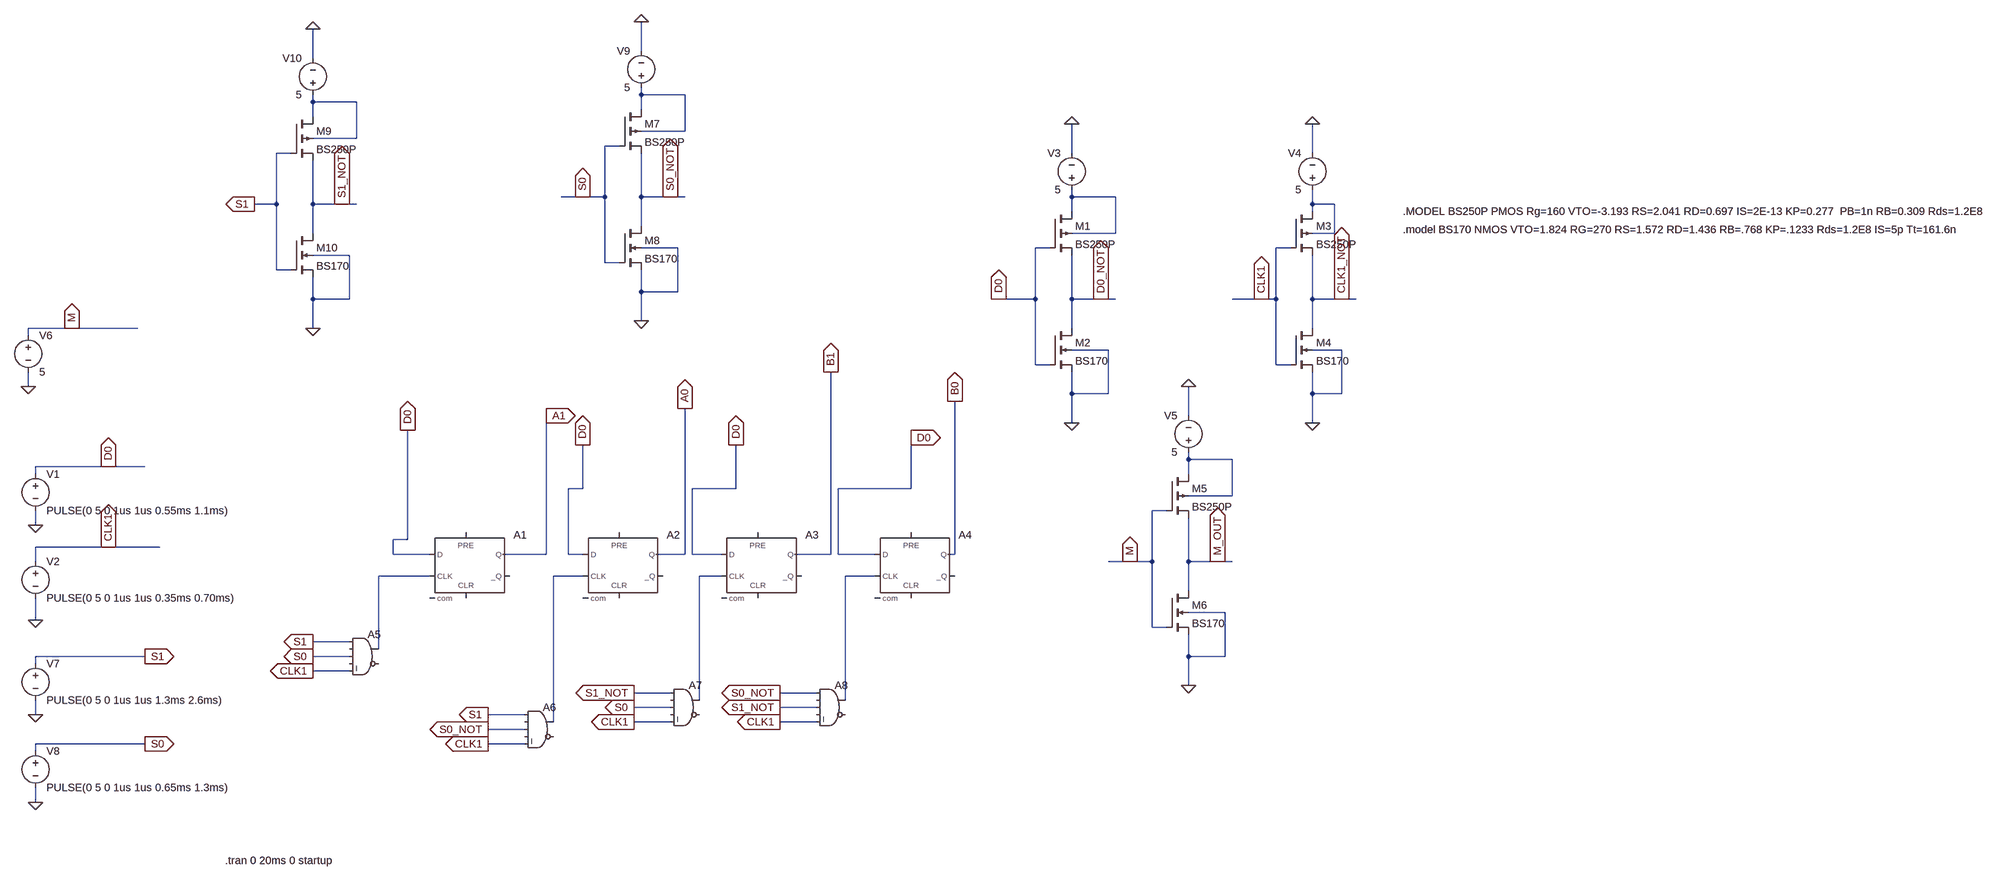
[diagram p0: schematic TASK_3.asc]
TASK_3.asc, the LTspice schematic file:
Version 4
SHEET 1 880 680
WIRE -3024 -2976 -3024 -3040
WIRE -3744 -2960 -3744 -3024
WIRE -3024 -2880 -3024 -2896
WIRE -2928 -2880 -3024 -2880
WIRE -3744 -2864 -3744 -2880
WIRE -3648 -2864 -3744 -2864
WIRE -3024 -2848 -3024 -2880
WIRE -3744 -2832 -3744 -2864
WIRE -2928 -2800 -2928 -2880
WIRE -2928 -2800 -3024 -2800
WIRE -3648 -2784 -3648 -2864
WIRE -3648 -2784 -3744 -2784
WIRE -3072 -2768 -3104 -2768
WIRE -3792 -2752 -3824 -2752
WIRE -2080 -2752 -2080 -2816
WIRE -1552 -2752 -1552 -2816
WIRE -3152 -2656 -3200 -2656
WIRE -3104 -2656 -3104 -2768
WIRE -3104 -2656 -3152 -2656
WIRE -3024 -2656 -3024 -2752
WIRE -2960 -2656 -3024 -2656
WIRE -2928 -2656 -2960 -2656
WIRE -2080 -2656 -2080 -2672
WIRE -1984 -2656 -2080 -2656
WIRE -3824 -2640 -3824 -2752
WIRE -3824 -2640 -3872 -2640
WIRE -3744 -2640 -3744 -2736
WIRE -3680 -2640 -3744 -2640
WIRE -3648 -2640 -3680 -2640
WIRE -1552 -2640 -1552 -2672
WIRE -1504 -2640 -1552 -2640
WIRE -2080 -2624 -2080 -2656
WIRE -1552 -2624 -1552 -2640
WIRE -3024 -2592 -3024 -2656
WIRE -3744 -2576 -3744 -2640
WIRE -1984 -2576 -1984 -2656
WIRE -1984 -2576 -2080 -2576
WIRE -1504 -2576 -1504 -2640
WIRE -1504 -2576 -1552 -2576
WIRE -2944 -2544 -3024 -2544
WIRE -2128 -2544 -2160 -2544
WIRE -1600 -2544 -1632 -2544
WIRE -3664 -2528 -3744 -2528
WIRE -3104 -2512 -3104 -2656
WIRE -3072 -2512 -3104 -2512
WIRE -3824 -2496 -3824 -2640
WIRE -3792 -2496 -3824 -2496
WIRE -3024 -2448 -3024 -2496
WIRE -2944 -2448 -2944 -2544
WIRE -2944 -2448 -3024 -2448
WIRE -3744 -2432 -3744 -2480
WIRE -3664 -2432 -3664 -2528
WIRE -3664 -2432 -3744 -2432
WIRE -2240 -2432 -2256 -2432
WIRE -2160 -2432 -2160 -2544
WIRE -2160 -2432 -2240 -2432
WIRE -2080 -2432 -2080 -2528
WIRE -2016 -2432 -2080 -2432
WIRE -1984 -2432 -2016 -2432
WIRE -1664 -2432 -1728 -2432
WIRE -1632 -2432 -1632 -2544
WIRE -1632 -2432 -1664 -2432
WIRE -1552 -2432 -1552 -2528
WIRE -1488 -2432 -1552 -2432
WIRE -1456 -2432 -1488 -2432
WIRE -3024 -2384 -3024 -2448
WIRE -4272 -2368 -4368 -2368
WIRE -4128 -2368 -4272 -2368
WIRE -3744 -2368 -3744 -2432
WIRE -2080 -2368 -2080 -2432
WIRE -1552 -2368 -1552 -2432
WIRE -4368 -2352 -4368 -2368
WIRE -2000 -2320 -2080 -2320
WIRE -1488 -2320 -1552 -2320
WIRE -2160 -2288 -2160 -2432
WIRE -2128 -2288 -2160 -2288
WIRE -1632 -2288 -1632 -2432
WIRE -1600 -2288 -1632 -2288
WIRE -4368 -2240 -4368 -2272
WIRE -2080 -2224 -2080 -2272
WIRE -2000 -2224 -2000 -2320
WIRE -2000 -2224 -2080 -2224
WIRE -1552 -2224 -1552 -2272
WIRE -1488 -2224 -1488 -2320
WIRE -1488 -2224 -1552 -2224
WIRE -3232 -2176 -3232 -2192
WIRE -1824 -2176 -1824 -2240
WIRE -2080 -2160 -2080 -2224
WIRE -1552 -2160 -1552 -2224
WIRE -2432 -2128 -2432 -2144
WIRE -1824 -2080 -1824 -2096
WIRE -1728 -2080 -1824 -2080
WIRE -4192 -2064 -4352 -2064
WIRE -4112 -2064 -4192 -2064
WIRE -4352 -2048 -4352 -2064
WIRE -1824 -2048 -1824 -2080
WIRE -3152 -2016 -3152 -2112
WIRE -3152 -2016 -3184 -2016
WIRE -2816 -2016 -2816 -2112
WIRE -2816 -2016 -2912 -2016
WIRE -2432 -2016 -2432 -2128
WIRE -2432 -2016 -2592 -2016
WIRE -1728 -2000 -1728 -2080
WIRE -1728 -2000 -1824 -2000
WIRE -1872 -1968 -1904 -1968
WIRE -4352 -1936 -4352 -1968
WIRE -3536 -1904 -3536 -2144
WIRE -3536 -1904 -3568 -1904
WIRE -4192 -1888 -4352 -1888
WIRE -4080 -1888 -4192 -1888
WIRE -3568 -1872 -3568 -1904
WIRE -3488 -1872 -3568 -1872
WIRE -3232 -1872 -3232 -2176
WIRE -3232 -1872 -3328 -1872
WIRE -3184 -1872 -3184 -2016
WIRE -3152 -1872 -3184 -1872
WIRE -2928 -1872 -2928 -2192
WIRE -2928 -1872 -2992 -1872
WIRE -2912 -1872 -2912 -2016
WIRE -2848 -1872 -2912 -1872
WIRE -2608 -1872 -2608 -2272
WIRE -2608 -1872 -2688 -1872
WIRE -2592 -1872 -2592 -2016
WIRE -2512 -1872 -2592 -1872
WIRE -2336 -1872 -2336 -2208
WIRE -2336 -1872 -2352 -1872
WIRE -4352 -1856 -4352 -1888
WIRE -1952 -1856 -2000 -1856
WIRE -1904 -1856 -1904 -1968
WIRE -1904 -1856 -1952 -1856
WIRE -1824 -1856 -1824 -1952
WIRE -1760 -1856 -1824 -1856
WIRE -1728 -1856 -1760 -1856
WIRE -3488 -1824 -3600 -1824
WIRE -3152 -1824 -3216 -1824
WIRE -2848 -1824 -2896 -1824
WIRE -2512 -1824 -2576 -1824
WIRE -1824 -1792 -1824 -1856
WIRE -1744 -1744 -1824 -1744
WIRE -4352 -1728 -4352 -1776
WIRE -1904 -1712 -1904 -1856
WIRE -1872 -1712 -1904 -1712
WIRE -3664 -1680 -3744 -1680
WIRE -3600 -1664 -3600 -1824
WIRE -4112 -1648 -4352 -1648
WIRE -3664 -1648 -3744 -1648
WIRE -1824 -1648 -1824 -1696
WIRE -1744 -1648 -1744 -1744
WIRE -1744 -1648 -1824 -1648
WIRE -4352 -1632 -4352 -1648
WIRE -3664 -1616 -3744 -1616
WIRE -1824 -1584 -1824 -1648
WIRE -2960 -1568 -3040 -1568
WIRE -2640 -1568 -2720 -1568
WIRE -2896 -1552 -2896 -1824
WIRE -2576 -1552 -2576 -1824
WIRE -2960 -1536 -3040 -1536
WIRE -2640 -1536 -2720 -1536
WIRE -4352 -1520 -4352 -1552
WIRE -3280 -1520 -3360 -1520
WIRE -3216 -1504 -3216 -1824
WIRE -2960 -1504 -3040 -1504
WIRE -2640 -1504 -2720 -1504
WIRE -3280 -1488 -3360 -1488
WIRE -4112 -1456 -4352 -1456
WIRE -3280 -1456 -3360 -1456
WIRE -4352 -1440 -4352 -1456
WIRE -4352 -1328 -4352 -1360
FLAG -4352 -1936 0
FLAG -4352 -1728 0
FLAG -4192 -2064 D0
IOPIN -4192 -2064 Out
FLAG -4192 -1888 CLK1
IOPIN -4192 -1888 Out
FLAG -2080 -2816 0
FLAG -2080 -2160 0
FLAG -1552 -2816 0
FLAG -1552 -2160 0
FLAG -2240 -2432 D0
IOPIN -2240 -2432 Out
FLAG -2016 -2432 D0_NOT
IOPIN -2016 -2432 Out
FLAG -1664 -2432 CLK1
IOPIN -1664 -2432 Out
FLAG -1488 -2432 CLK1_NOT
IOPIN -1488 -2432 Out
FLAG -1824 -2240 0
FLAG -1824 -1584 0
FLAG -4368 -2240 0
FLAG -4272 -2368 M
IOPIN -4272 -2368 Out
FLAG -1952 -1856 M
IOPIN -1952 -1856 Out
FLAG -1760 -1856 M_OUT
IOPIN -1760 -1856 Out
FLAG -4352 -1520 0
FLAG -4352 -1328 0
FLAG -3024 -3040 0
FLAG -3024 -2384 0
FLAG -3152 -2656 S0
IOPIN -3152 -2656 Out
FLAG -2960 -2656 S0_NOT
IOPIN -2960 -2656 Out
FLAG -3744 -3024 0
FLAG -3744 -2368 0
FLAG -3872 -2640 S1
IOPIN -3872 -2640 Out
FLAG -3680 -2640 S1_NOT
IOPIN -3680 -2640 Out
FLAG -4112 -1648 S1
IOPIN -4112 -1648 Out
FLAG -4112 -1456 S0
IOPIN -4112 -1456 Out
FLAG -3536 -2144 D0
IOPIN -3536 -2144 Out
FLAG -3152 -2112 D0
IOPIN -3152 -2112 Out
FLAG -2816 -2112 D0
IOPIN -2816 -2112 Out
FLAG -2432 -2128 D0
IOPIN -2432 -2128 Out
FLAG -3232 -2176 A1
IOPIN -3232 -2176 Out
FLAG -2928 -2192 A0
IOPIN -2928 -2192 Out
FLAG -2608 -2272 B1
IOPIN -2608 -2272 Out
FLAG -2336 -2208 B0
IOPIN -2336 -2208 Out
FLAG -3744 -1680 S1
IOPIN -3744 -1680 Out
FLAG -3744 -1648 S0
IOPIN -3744 -1648 Out
FLAG -3744 -1616 CLK1
IOPIN -3744 -1616 Out
FLAG -3360 -1520 S1
IOPIN -3360 -1520 Out
FLAG -3360 -1456 CLK1
IOPIN -3360 -1456 Out
FLAG -3040 -1536 S0
IOPIN -3040 -1536 Out
FLAG -3040 -1504 CLK1
IOPIN -3040 -1504 Out
FLAG -2720 -1504 CLK1
IOPIN -2720 -1504 Out
FLAG -3360 -1488 S0_NOT
IOPIN -3360 -1488 Out
FLAG -3040 -1568 S1_NOT
IOPIN -3040 -1568 Out
FLAG -2720 -1568 S0_NOT
IOPIN -2720 -1568 Out
FLAG -2720 -1536 S1_NOT
IOPIN -2720 -1536 Out
SYMBOL voltage -4352 -2064 R0
WINDOW 123 0 0 Left 2
WINDOW 39 0 0 Left 2
SYMATTR InstName V1
SYMATTR Value PULSE(0 5 0 1us 1us 0.55ms 1.1ms)
SYMBOL voltage -4352 -1872 R0
WINDOW 123 0 0 Left 2
WINDOW 39 0 0 Left 2
SYMATTR InstName V2
SYMATTR Value PULSE(0 5 0 1us 1us 0.35ms 0.70ms)
SYMBOL Digital\\dflop -3408 -1920 R0
SYMATTR InstName A1
SYMBOL Digital\\dflop -3072 -1920 R0
SYMATTR InstName A2
SYMBOL Digital\\dflop -2768 -1920 R0
SYMATTR InstName A3
SYMBOL Digital\\dflop -2432 -1920 R0
SYMATTR InstName A4
SYMBOL pmos4 -2128 -2624 R0
SYMATTR InstName M1
SYMATTR Value BS250P
SYMBOL nmos4 -2128 -2368 R0
SYMATTR InstName M2
SYMATTR Value BS170
SYMBOL voltage -2080 -2656 R180
WINDOW 0 24 96 Left 2
WINDOW 3 24 16 Left 2
WINDOW 123 0 0 Left 2
WINDOW 39 0 0 Left 2
SYMATTR InstName V3
SYMATTR Value 5
SYMBOL pmos4 -1600 -2624 R0
SYMATTR InstName M3
SYMATTR Value BS250P
SYMBOL nmos4 -1600 -2368 R0
SYMATTR InstName M4
SYMATTR Value BS170
SYMBOL voltage -1552 -2656 R180
WINDOW 0 24 96 Left 2
WINDOW 3 24 16 Left 2
WINDOW 123 0 0 Left 2
WINDOW 39 0 0 Left 2
SYMATTR InstName V4
SYMATTR Value 5
SYMBOL pmos4 -1872 -2048 R0
SYMATTR InstName M5
SYMATTR Value BS250P
SYMBOL nmos4 -1872 -1792 R0
SYMATTR InstName M6
SYMATTR Value BS170
SYMBOL voltage -1824 -2080 R180
WINDOW 0 24 96 Left 2
WINDOW 3 24 16 Left 2
WINDOW 123 0 0 Left 2
WINDOW 39 0 0 Left 2
SYMATTR InstName V5
SYMATTR Value 5
SYMBOL voltage -4368 -2368 R0
WINDOW 123 0 0 Left 2
WINDOW 39 0 0 Left 2
SYMATTR InstName V6
SYMATTR Value 5
SYMBOL voltage -4352 -1648 R0
WINDOW 123 0 0 Left 2
WINDOW 39 0 0 Left 2
SYMATTR InstName V7
SYMATTR Value PULSE(0 5 0 1us 1us 1.3ms 2.6ms)
SYMBOL voltage -4352 -1456 R0
WINDOW 123 0 0 Left 2
WINDOW 39 0 0 Left 2
SYMATTR InstName V8
SYMATTR Value PULSE(0 5 0 1us 1us 0.65ms 1.3ms)
SYMBOL pmos4 -3072 -2848 R0
SYMATTR InstName M7
SYMATTR Value BS250P
SYMBOL nmos4 -3072 -2592 R0
SYMATTR InstName M8
SYMATTR Value BS170
SYMBOL voltage -3024 -2880 R180
WINDOW 0 24 96 Left 2
WINDOW 3 24 16 Left 2
WINDOW 123 0 0 Left 2
WINDOW 39 0 0 Left 2
SYMATTR InstName V9
SYMATTR Value 5
SYMBOL pmos4 -3792 -2832 R0
SYMATTR InstName M9
SYMATTR Value BS250P
SYMBOL nmos4 -3792 -2576 R0
SYMATTR InstName M10
SYMATTR Value BS170
SYMBOL voltage -3744 -2864 R180
WINDOW 0 24 96 Left 2
WINDOW 3 24 16 Left 2
WINDOW 123 0 0 Left 2
WINDOW 39 0 0 Left 2
SYMATTR InstName V10
SYMATTR Value 5
SYMBOL Digital\\and -3632 -1712 R0
SYMATTR InstName A5
SYMBOL Digital\\and -3248 -1552 R0
SYMATTR InstName A6
SYMBOL Digital\\and -2928 -1600 R0
SYMATTR InstName A7
SYMBOL Digital\\and -2608 -1600 R0
SYMATTR InstName A8
TEXT -3936 -1200 Left 2 !.tran 0 20ms 0 startup
TEXT -1352 -2624 Left 2 !.MODEL BS250P PMOS Rg=160 VTO=-3.193 RS=2.041 RD=0.697 IS=2E-13 KP=0.277  PB=1n RB=0.309 Rds=1.2E8
TEXT -1352 -2584 Left 2 !.model BS170 NMOS VTO=1.824 RG=270 RS=1.572 RD=1.436 RB=.768 KP=.1233 Rds=1.2E8 IS=5p Tt=161.6n

The netlist it stands for:
* TASK_3.asc
V1 D0 0 PULSE(0 5 0 1us 1us 0.55ms 1.1ms)
V2 CLK1 0 PULSE(0 5 0 1us 1us 0.35ms 0.70ms)
A1 D0 0 N006 0 0 0 A1 0 DFLOP
A2 D0 0 N007 0 0 0 A0 0 DFLOP
A3 D0 0 N008 0 0 0 B1 0 DFLOP
A4 D0 0 N009 0 0 0 B0 0 DFLOP
M1 N003 D0 D0_NOT N003 BS250P
M2 D0_NOT D0 0 0 BS170
V3 N003 0 5
M3 N004 CLK1 CLK1_NOT N004 BS250P
M4 CLK1_NOT CLK1 0 0 BS170
V4 N004 0 5
M5 N005 M M_OUT N005 BS250P
M6 M_OUT M 0 0 BS170
V5 N005 0 5
V6 M 0 5
V7 S1 0 PULSE(0 5 0 1us 1us 1.3ms 2.6ms)
V8 S0 0 PULSE(0 5 0 1us 1us 0.65ms 1.3ms)
M7 N001 S0 S0_NOT N001 BS250P
M8 S0_NOT S0 0 0 BS170
V9 N001 0 5
M9 N002 S1 S1_NOT N002 BS250P
M10 S1_NOT S1 0 0 BS170
V10 N002 0 5
A5 S1 0 S0 0 CLK1 0 N006 0 AND
A6 S1 0 S0_NOT 0 CLK1 0 N007 0 AND
A7 S1_NOT 0 S0 0 CLK1 0 N008 0 AND
A8 S0_NOT 0 S1_NOT 0 CLK1 0 N009 0 AND
.model NMOS NMOS
.model PMOS PMOS
.lib standard.mos
.tran 0 20ms 0 startup
.MODEL BS250P PMOS Rg=160 VTO=-3.193 RS=2.041 RD=0.697 IS=2E-13 KP=0.277  PB=1n RB=0.309 Rds=1.2E8
.model BS170 NMOS VTO=1.824 RG=270 RS=1.572 RD=1.436 RB=.768 KP=.1233 Rds=1.2E8 IS=5p Tt=161.6n
.backanno
.end